# EAGLE board WB_2.8 (EAGLE 6.4), part 1 of 2
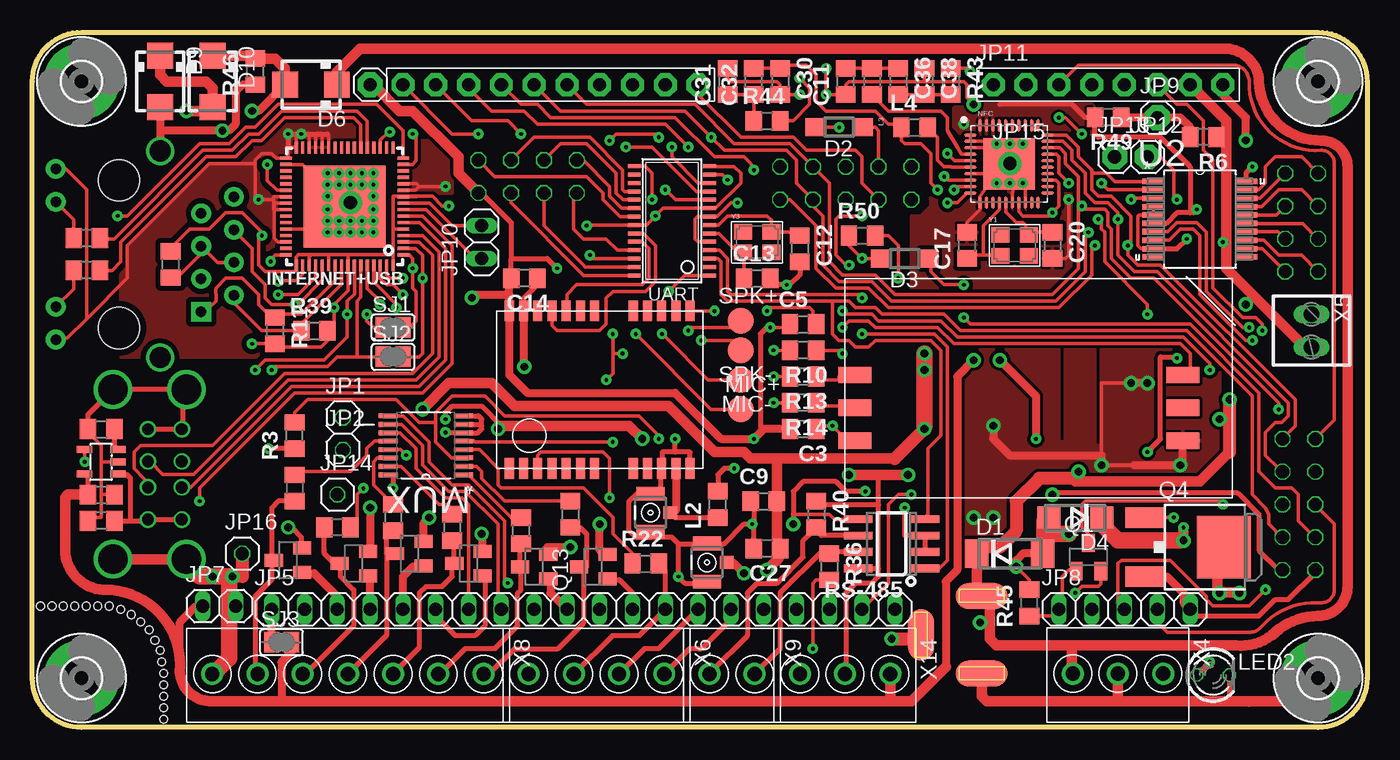
[diagram p5: board, top side]
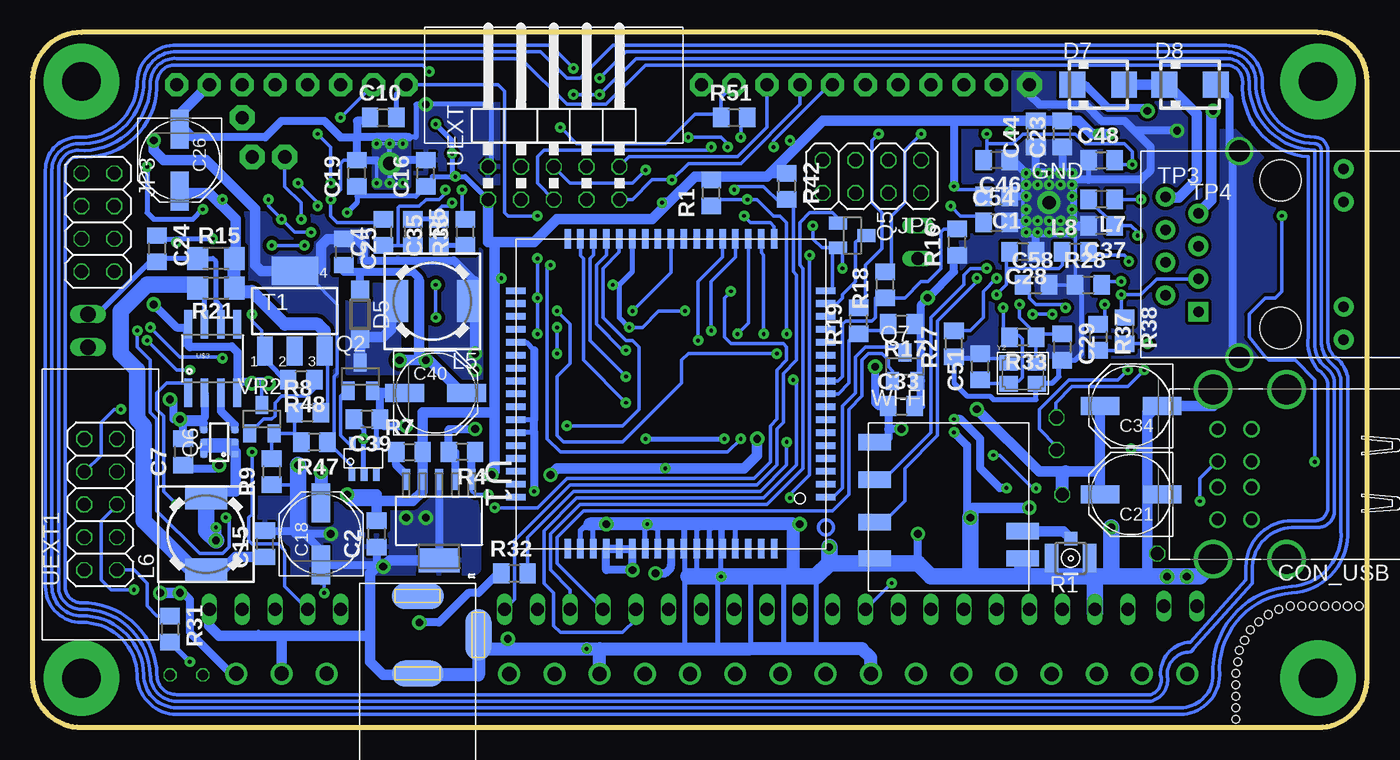
[diagram p6: board, bottom side, seen from below]

Size 103.38 x 53.85 mm. Coordinates in mm from the lower left corner, seen from the top.
Outline: 0,50.04 arc-90 3.81,53.85 99.57,53.85 arc-90 103.38,50.04 103.38,3.81 arc-90 99.57,0 3.81,0 arc-90 0,3.81 0,50.04
Copper layers (1*16): Top 0.035mm / dielectric 1.5mm / Bottom 0.035mm
Design rules "default": minimum track width 10mil, minimum drill 0.3mm, track to track 8mil, track to pad 8mil, pad to pad 8mil, via to via 8mil, smd to smd 8mil, copper to edge 20mil, drill to drill 10mil, minimum pad ring 4mil, minimum via ring 10mil, stop-mask expansion 6mil, vias tented up to drill 50mil, thermal gap 8mil
Net classes: 1 PWR: width 0.203 mm, drill 0.4 mm, clearance 0.076 mm
Holes 0.6 mm at 0.63,9.4 1.52,9.4 5.08,9.4 5.97,9.4 7.65,8.74 8.41,8.18 9.07,7.54 9.91,5.97 10.03,5.08 10.16,4.19 10.16,2.41 10.16,1.52 10.16,0.64 10.16,3.3 2.41,9.4 3.3,9.4 4.19,9.4 6.83,9.14 9.5,6.76
tRestrict: area 33,34.5 to 34,34.8

## Footprints (pad centres in the part's own frame; a part is rotated, then mirrored left to right if it is on the bottom)
C0805_5MIL_D = smd 1.27 x 1.524: 1 -1.016,0; 2 1.016,0
PANASONIC_D = smd 3 x 1.4: + 2.4,0; - -2.4,0
HR911105A = drill 0.813 pad 1.524 square: 1 4.445,-6.35 | drill 0.813 pad 1.524: 2 3.175,-8.89; 3 1.905,-6.35; 4 0.635,-8.89; 5 -0.635,-6.35; 6 -1.905,-8.89; 7 -3.175,-6.35; 8 -4.445,-8.89; 9 6.604,4.902; 10 4.064,4.902; 11 -4.064,4.902; 12 -6.604,4.902 | drill 1.651 pad 2.159: 13 8.001,-3.175; 14 -8.001,-3.175 | hole 3.2: 5.715,0; -5.715,0
2P = drill 0.92 pad 1.27: 1-1 3.98,3.5; 1-2 3.98,1; 1-3 3.98,-1; 1-4 3.98,-3.5; 2-1 6.6,3.5; 2-2 6.6,1; 2-3 6.6,-1; 2-4 6.6,-3.5 | drill 2.3 pad 3: M1 1.27,6.57; M2 1.27,-6.57; M3 6.95,6.57; M4 6.95,-6.57
DO214AA = smd 1.8 x 2.2: A 2.55,0; C -2.55,0
SOD123 = smd 1.4 x 1.4: A 1.9,0; C -1.9,0
DO214AC = smd 1.8 x 1.7: A 2.05,0; C -2.05,0
SMA = smd 2 x 2: A 2,0; C -2,0
1X01-CLEANBIG = drill 1.016 pad 1.778: 1 0,0
SMT = smd 1.5 x 0.508: 1 -11.64,7.27; 2 -11.64,6.27; 3 -11.64,5.27; 4 -11.64,4.27; 5 -11.64,3.27; 6 -11.64,2.27; 7 -11.64,1.27; 8 -11.64,0.27; 9 -11.64,-0.73; 10 -11.64,-1.73; 11 -11.64,-2.73; 12 -11.64,-3.73; 13 -11.64,-4.73; 14 -11.64,-5.73; 15 -11.64,-6.73; 16 -11.64,-7.73; 17 -11.64,-8.73; 35 12.36,-8.73; 36 12.36,-7.73; 37 12.36,-6.73; 38 12.36,-5.73; 39 12.36,-4.73; 40 12.36,-3.73; 41 12.36,-2.73; 42 12.36,-1.73; 43 12.36,-0.73; 44 12.36,0.27; 45 12.36,1.27; 46 12.36,2.27; 47 12.36,3.27; 48 12.36,4.27; 49 12.36,5.27; 50 12.36,6.27; 51 12.36,7.27 | smd 0.508 x 1.5: 18 -7.64,-12.73; 19 -6.64,-12.73; 20 -5.64,-12.73; 21 -4.64,-12.73; 22 -3.64,-12.73; 23 -2.64,-12.73; 24 -1.64,-12.73; 25 -0.64,-12.73; 26 0.36,-12.73; 27 1.36,-12.73; 28 2.36,-12.73; 29 3.36,-12.73; 30 4.36,-12.73; 31 5.36,-12.73; 32 6.36,-12.73; 33 7.36,-12.73; 34 8.36,-12.73; 52 8.36,11.27; 53 7.36,11.27; 54 6.36,11.27; 55 5.36,11.27; 56 4.36,11.27; 57 3.36,11.27; 58 2.36,11.27; 59 1.36,11.27; 60 0.36,11.27; 61 -0.64,11.27; 62 -1.64,11.27; 63 -2.64,11.27; 64 -3.64,11.27; 65 -4.64,11.27; 66 -5.64,11.27; 67 -6.64,11.27; 68 -7.64,11.27
3,0-PAD = drill 3 pad 5.842: B3,0 0,0
QFN64 = smd 0.9 x 0.25: 1 -4.55,3.75; 2 -4.55,3.25; 3 -4.55,2.75; 4 -4.55,2.25; 5 -4.55,1.75; 6 -4.55,1.25; 7 -4.55,0.75; 8 -4.55,0.25; 9 -4.55,-0.25; 10 -4.55,-0.75; 11 -4.55,-1.25; 12 -4.55,-1.75; 13 -4.55,-2.25; 14 -4.55,-2.75; 15 -4.55,-3.25; 16 -4.55,-3.75; 33 4.55,-3.75; 34 4.55,-3.25; 35 4.55,-2.75; 36 4.55,-2.25; 37 4.55,-1.75; 38 4.55,-1.25; 39 4.55,-0.75; 40 4.55,-0.25; 41 4.55,0.25; 42 4.55,0.75; 43 4.55,1.25; 44 4.55,1.75; 45 4.55,2.25; 46 4.55,2.75; 47 4.55,3.25; 48 4.55,3.75 | smd 0.25 x 0.9: 17 -3.75,-4.55; 18 -3.25,-4.55; 19 -2.75,-4.55; 20 -2.25,-4.55; 21 -1.75,-4.55; 22 -1.25,-4.55; 23 -0.75,-4.55; 24 -0.25,-4.55; 25 0.25,-4.55; 26 0.75,-4.55; 27 1.25,-4.55; 28 1.75,-4.55; 29 2.25,-4.55; 30 2.75,-4.55; 31 3.25,-4.55; 32 3.75,-4.55; 49 3.75,4.55; 50 3.25,4.55; 51 2.75,4.55; 52 2.25,4.55; 53 1.75,4.55; 54 1.25,4.55; 55 0.75,4.55; 56 0.25,4.55; 57 -0.25,4.55; 58 -0.75,4.55; 59 -1.25,4.55; 60 -1.75,4.55; 61 -2.25,4.55; 62 -2.75,4.55; 63 -3.25,4.55; 64 -3.75,4.55 | smd 6.35 x 6.35: 65 0,0
1X01 = drill 1.016 octagon: 1 0,0
2X04 = drill 1.016 octagon: 1 -3.81,-1.27; 2 -3.81,1.27; 3 -1.27,-1.27; 4 -1.27,1.27; 5 1.27,-1.27; 6 1.27,1.27; 7 3.81,-1.27; 8 3.81,1.27
1X01' = drill 1.016 pad 1.93 octagon: 1 0,0
1X20 = drill 1.016 long: 1 -24.13,0; 2 -21.59,0; 3 -19.05,0; 4 -16.51,0; 5 -13.97,0; 6 -11.43,0; 7 -8.89,0; 8 -6.35,0; 9 -3.81,0; 10 -1.27,0; 11 1.27,0; 12 3.81,0; 13 6.35,0; 14 8.89,0; 15 11.43,0; 16 13.97,0; 17 16.51,0; 18 19.05,0; 19 21.59,0; 20 24.13,0
1X02 = drill 1.016 long: 1 -1.27,0; 2 1.27,0
1X05 = drill 1.016 long: 1 -5.08,0; 2 -2.54,0; 3 0,0; 4 2.54,0; 5 5.08,0
1X08-BIG = drill 1.016 pad 1.778 octagon: 1 -8.89,0; 2 -6.35,0; 3 -3.81,0; 4 -1.27,0; 5 1.27,0; 6 3.81,0; 7 6.35,0; 8 8.89,0
L0805_5MIL_D = smd 1.27 x 1.524: 1 -1.016,0; 2 1.016,0
DR74 = smd 1.8 x 3.25: 1 -2.8,0; 2 2.8,0
LED3MM = drill 0.813 octagon: A -1.27,0; K 1.27,0
TP20R = smd 2 x 2: TP 0,0
SOP65P640X120-16N = smd 1.473 x 0.356: 1 -2.921,2.286; 2 -2.921,1.626; 3 -2.921,0.965; 4 -2.921,0.33; 5 -2.921,-0.33; 6 -2.921,-0.965; 7 -2.921,-1.626; 8 -2.921,-2.286; 9 2.921,-2.286; 10 2.921,-1.626; 11 2.921,-0.965; 12 2.921,-0.33; 13 2.921,0.33; 14 2.921,0.965; 15 2.921,1.626; 16 2.921,2.286
HVQFN40-6X6 = smd 1 x 0.25: 1 -2.99,2.25; 2 -2.99,1.75; 3 -2.99,1.25; 4 -2.99,0.75; 5 -2.99,0.25; 6 -2.99,-0.25; 7 -2.99,-0.75; 8 -2.99,-1.25; 9 -2.99,-1.75; 10 -2.99,-2.25; 21 2.99,-2.25; 22 2.99,-1.75; 23 2.99,-1.25; 24 2.99,-0.75; 25 2.99,-0.25; 26 2.99,0.25; 27 2.99,0.75; 28 2.99,1.25; 29 2.99,1.75; 30 2.99,2.25 | smd 0.25 x 1: 11 -2.25,-2.99; 12 -1.75,-2.99; 13 -1.25,-2.99; 14 -0.75,-2.99; 15 -0.25,-2.99; 16 0.25,-2.99; 17 0.75,-2.99; 18 1.25,-2.99; 19 1.75,-2.99; 20 2.25,-2.99; 31 2.25,2.99; 32 1.75,2.99; 33 1.25,2.99; 34 0.75,2.99; 35 0.25,2.99; 36 -0.25,2.99; 37 -0.75,2.99; 38 -1.25,2.99; 39 -1.75,2.99; 40 -2.25,2.99 | smd 4 x 4: TP 0,0
SO-6/4 = smd 0.508 x 1.016: 1 -0.4,-1.5; 2 0.55,-1.5; 3 1.5,-1.5; 4 1.5,0.9; 5 -0.365,0.9
1 = smd 4 x 2 bottom: 1 0,7; P$4 0,1 | smd 4 x 2: 2 0,7; P$1 0,1 | smd 2 x 4 bottom: P$5 4.7,4 | smd 2 x 4: P$6 4.7,4
SOT23 = smd 1 x 1.4: 1 -0.95,-1.1; 2 0.95,-1.1; 3 0,1.1
DPAK = smd 1.6 x 3: 1 -2.28,-4.04; 3 2.28,-4.04 | smd 4.826 x 4.191: 4 0,2.096
SC74_INFINEON = smd 0.5 x 0.5: 1 -0.95,-1.2; 2 0,-1.2; 3 0.95,-1.2; 4 0.95,1.2; 5 0,1.2; 6 -0.95,1.2
R0805_5MIL_D = smd 1.27 x 1.524: 1 -1.016,0; 2 1.016,0
R1206 = smd 1.6 x 1.803: 1 -1.422,0; 2 1.422,0
SOIC8 = smd 0.6 x 2.2: 1 -1.905,-2.6; 2 -0.635,-2.6; 3 0.635,-2.6; 4 1.905,-2.6; 5 1.905,2.6; 6 0.635,2.6; 7 -0.635,2.6; 8 -1.905,2.6
SIM68V = smd 1.6 x 0.7: 1 -6.35,6.62; 2 -6.35,5.52; 3 -6.35,4.42; 4 -6.35,3.32; 5 -6.35,2.22; 6 -6.35,1.12; 7 -6.35,0.02; 8 -6.35,-2.98; 9 -6.35,-4.08; 10 -6.35,-5.18; 11 -6.35,-6.28; 12 -6.35,-7.38; 13 5.85,-7.38; 14 5.85,-6.28; 15 5.85,-5.18; 16 5.85,-4.08; 17 5.85,-2.98; 18 5.85,0.02; 19 5.85,1.12; 20 5.85,2.22; 21 5.85,3.32; 22 5.85,4.42; 23 5.85,5.52; 24 5.85,6.62
BIGSIM = smd 2.54 x 1.27: 1 14.24,2.54; 2 14.24,0; 3 14.24,-2.54; 4 -11.16,2.54; 5 -11.16,0; 6 -11.16,-2.54
SJ = smd 1.168 x 1.6: 1 -0.762,0; 2 0.762,0
SOT223 = smd 1.219 x 2.235: 1 -2.311,-3.099; 2 0,-3.099; 3 2.311,-3.099 | smd 3.6 x 2.2: 4 0,3.099
B1,27 = smd 1.27 x 1.27: TP 0,0
SOT230P700X180-6N = smd 1.626 x 0.61: 1 -3.2,2.54; 2 -3.2,1.27; 3 -3.2,0; 4 -3.2,-1.27; 5 -3.2,-2.54 | smd 1.854 x 3.175: 6 3.073,0
SOP65P780X200-20N = smd 1.676 x 0.432: 1 -3.607,2.921; 2 -3.607,2.286; 3 -3.607,1.626; 4 -3.607,0.965; 5 -3.607,0.33; 6 -3.607,-0.33; 7 -3.607,-0.965; 8 -3.607,-1.626; 9 -3.607,-2.286; 10 -3.607,-2.921; 11 3.607,-2.921; 12 3.607,-2.286; 13 3.607,-1.626; 14 3.607,-0.965; 15 3.607,-0.33; 16 3.607,0.33; 17 3.607,0.965; 18 3.607,1.626; 19 3.607,2.286; 20 3.607,2.921
SOIC-8 = smd 0.61 x 2.21: 1 -1.905,-2.54; 2 -0.635,-2.54; 3 0.635,-2.54; 4 1.905,-2.54; 5 1.905,2.794; 6 0.635,2.794; 7 -0.635,2.794; 8 -1.905,2.794
1X10-BIG = drill 1.016 pad 1.778 octagon: 1 -11.43,0; 2 -8.89,0; 3 -6.35,0; 4 -3.81,0; 5 -1.27,0; 6 1.27,0; 7 3.81,0; 8 6.35,0; 9 8.89,0; 10 11.43,0
SOT23-5L = smd 0.55 x 1.2: 1 -0.95,-1.3; 2 0,-1.3; 3 0.95,-1.3; 4 0.95,1.3; 5 -0.95,1.3
TSSOP28 = smd 0.305 x 0.991: CDA -3.575,2.918; CDB 0.975,2.918; CS 1.625,-2.918; CTSA -3.575,-2.918; CTSB 3.575,2.918; DSRA -2.275,2.918; DSRB 2.275,2.918; DTRA -2.925,2.918; DTRB 1.625,2.918; IRQ 4.225,2.918; RESET -1.625,-2.918; RIA -4.225,2.918; RIB 0.325,2.918; RTSA -4.225,-2.918; RTSB 2.925,2.918; RXA -2.275,-2.918; RXB -1.625,2.918; SCLK 3.575,-2.918; SI 2.275,-2.918; SO 2.925,-2.918; SPI 0.975,-2.918; TXA -2.925,-2.918; TXB -0.975,2.918; VDD 0.325,-2.918; VSS 4.225,-2.918; VSS2 -0.325,2.918; XTAL1 -0.975,-2.918; XTAL2 -0.325,-2.918
2X05/90 = drill 1.016 octagon: 1 -5.08,-6.35; 2 -5.08,-3.81; 3 -2.54,-6.35; 4 -2.54,-3.81; 5 0,-6.35; 6 0,-3.81; 7 2.54,-6.35; 8 2.54,-3.81; 9 5.08,-6.35; 10 5.08,-3.81
2X05 = drill 1.016 octagon: 1 -5.08,-1.27; 2 -5.08,1.27; 3 -2.54,-1.27; 4 -2.54,1.27; 5 0,-1.27; 6 0,1.27; 7 2.54,-1.27; 8 2.54,1.27; 9 5.08,-1.27; 10 5.08,1.27
BL-8188-PACK = smd 2.54 x 1.27: 3.3V -5.73,5; ANT 5.73,-1.9; DM- -5.73,2.1; DP+ -5.73,-1.2; GND1 -5.73,-4; GND2 5.73,-4
MC-921 = smd 1 x 1.05: 1 0,1.528 | smd 1.05 x 2.2: 2@1 -1.475,0; 2@2 1.475,0
1751251 = drill 1.1 pad 1.7: 1 -3.5,-0.1; 2 0,-0.1; 3 3.5,-0.1
2POL254 = drill 1.2 long: 1 -1.27,0; 2 1.27,0
1751264 = drill 1.1 pad 1.7: 1 -5.25,-0.1; 2 -1.75,-0.1; 3 1.75,-0.1; 4 5.25,-0.1
1751293 = drill 1.1 pad 1.7: 1 -10.5,-0.1; 2 -7,-0.1; 3 -3.5,-0.1; 4 0,-0.1; 5 3.5,-0.1; 6 7,-0.1; 7 10.5,-0.1
1751248 = drill 1.1 pad 1.7: 1 -1.75,-0.1; 2 1.75,-0.1
CRYSTAL_3.2X2.5 = smd 1.4 x 1.2: 1 -1.1,-0.8; 2 1.1,0.8; GND1 -1.1,0.8; GND2 1.1,-0.8

## Placement (x,y rotation side)
C1  10uF  [C0805_5MIL_D]  28.7,41.15 180 bottom
C2  10uF  [C0805_5MIL_D]  76.71,14.99 90 bottom
C3  100nF  [C0805_5MIL_D]  59.69,23.11 180 top
C4  100nF  [C0805_5MIL_D]  76.2,38.35 90 bottom
C5  10uF  [C0805_5MIL_D]  59.69,31.24 0 top
C6  10uF  [C0805_5MIL_D]  5.33,18.03 0 top
C7  10uF25V  [C0805_5MIL_D]  91.69,21.34 90 bottom
C9  10uF  [C0805_5MIL_D]  56.64,17.53 0 top
C10  10uF  [C0805_5MIL_D]  76.2,47.24 0 bottom
C11  220pF  [C0805_5MIL_D]  62.99,50.04 90 top
C12  22pF  [C0805_5MIL_D]  59.44,37.08 270 top
C13  22pF  [C0805_5MIL_D]  56.13,34.8 0 top
C14  10uF  [C0805_5MIL_D]  38.1,34.8 180 top
C15  10uF  [C0805_5MIL_D]  85.34,14.22 90 bottom
C16  10uF  [C0805_5MIL_D]  72.9,42.93 90 bottom
C17  22pF  [C0805_5MIL_D]  72.39,37.34 90 top
C18  100uF 25V  [PANASONIC_D]  81.03,14.99 90 bottom
C19  100nF  [C0805_5MIL_D]  78.23,42.93 90 bottom
C20  22pF  [C0805_5MIL_D]  78.99,37.34 270 top
C21  330uF 6.3V  [PANASONIC_D]  18.29,18.03 180 bottom
C22  10uF  [C0805_5MIL_D]  5.33,16 180 top
C23  100nF  [C0805_5MIL_D]  23.62,45.97 90 bottom
C24  10uF  [C0805_5MIL_D]  93.73,37.08 270 bottom
C25  10uF  [C0805_5MIL_D]  79.25,36.83 270 bottom
C26  330uF 6.3V  [PANASONIC_D]  91.95,43.94 270 bottom
C27  100nF  [C0805_5MIL_D]  56.9,13.84 180 top
C28  10uF  [C0805_5MIL_D]  26.67,36.83 180 bottom
C29  22pF  [C0805_5MIL_D]  23.62,29.46 270 bottom
C30  220pF  [C0805_5MIL_D]  57.91,50.04 270 top
C31  56pF  [C0805_5MIL_D]  53.85,50.04 90 top
C32  22pF  [C0805_5MIL_D]  55.88,50.04 90 top
C33  10uF  [C0805_5MIL_D]  36.07,24.89 0 bottom
C34  330uF 6.3V  [PANASONIC_D]  18.29,24.89 180 bottom
C35  1000pF 20%  [C0805_5MIL_D]  71.88,38.35 90 bottom
C36  22pF  [C0805_5MIL_D]  67.06,50.04 270 top
C37  100nF  [C0805_5MIL_D]  20.57,38.86 180 bottom
C38  56pF  [C0805_5MIL_D]  69.09,50.04 270 top
C39  10uF  [C0805_5MIL_D]  77.47,23.88 180 bottom
C40  100uF 6.3V  [PANASONIC_D]  72.14,25.91 0 bottom
C44  100nF  [C0805_5MIL_D]  25.65,45.97 90 bottom
C46  100nF  [C0805_5MIL_D]  28.7,43.94 180 bottom
C48  10uF  [C0805_5MIL_D]  20.57,43.94 0 bottom
C51  22pF  [C0805_5MIL_D]  29.97,27.94 90 bottom
C54  100nF  [C0805_5MIL_D]  28.7,39.12 0 bottom
C58  10uF  [C0805_5MIL_D]  25.65,34.28 0 bottom
CON_ETHERNET  HR911105A  [HR911105A]  6.72,36.65 270 bottom
CON_USB  USB_2P  [2P]  4.98,19.6 180 bottom
D1  SM6T22A  [DO214AA]  75.69,13.46 0 top
D2  PMEG3010ER  [SOD123]  62.48,46.48 180 top
D3  PMEG3010ER  [SOD123]  67.56,36.32 180 top
D4  PMEG4030EP  [DO214AC]  80.77,16.26 180 top
D5  PMEG3010ER  [SOD123]  77.98,32 270 bottom
D6  S1G-13-F (any SMA)  [SMA]  21.59,49.78 180 top
D7  S1G-13-F (any SMA)  [SMA]  20.83,49.78 0 bottom
D8  S1G-13-F (any SMA)  [SMA]  13.72,49.78 0 bottom
D9  S1G-13-F (any SMA)  [SMA]  9.91,50.04 270 top
D10  S1G-13-F (any SMA)  [SMA]  13.97,50.04 270 top
GND  [1X01-CLEANBIG]  24.64,40.64 0 bottom
GSM1  SIM900TOP_LAY  [SMT]  53.56,25.11 180 bottom
H1  MOUNT-PAD-ROUND3.0  [3,0-PAD]  3.81,3.81 0 top
H2  MOUNT-PAD-ROUND3.0  [3,0-PAD]  99.57,3.81 0 top
H3  MOUNT-PAD-ROUND3.0  [3,0-PAD]  3.81,50.04 0 top
H4  MOUNT-PAD-ROUND3.0  [3,0-PAD]  99.57,50.04 0 top
INTERNET+USB  LAN9514  [QFN64]  24.2,40.36 180 top
JP1  pin hole  [1X01]  24.05,24 0 top
JP2  pin hole  [1X01]  24.05,21.49 0 top
JP3  [2X04]  98.3,39.12 270 bottom
JP4  [1X01']  26.16,49.78 0 top
JP5  [1X20]  42.67,9.14 0 top
JP6  [2X04]  38.35,42.67 180 bottom
JP7  [1X02]  14.48,9.4 0 top
JP8  [1X05]  84.58,9.14 0 top
JP9  pin hole  [1X01']  87.12,47.24 0 top
JP10  [1X02]  34.8,37.59 90 top
JP11  [1X08-BIG]  83.31,49.78 0 top
JP12  [1X01']  86.36,44.2 0 top
JP13  [1X01']  83.82,44.2 0 top
JP14  [1X01]  23.62,18.03 0 top
JP15  [1X01-CLEANBIG]  75.69,43.69 0 top
JP16  [1X01]  16.26,13.46 0 top
L2  100nH 500mA  [L0805_5MIL_D]  53.09,17.27 90 top
L3  560nH 5%  [L0805_5MIL_D]  65.02,50.04 270 top
L4  560nH 5%  [L0805_5MIL_D]  68.33,46.48 0 top
L5  10 uH  [DR74]  72.39,33.02 180 bottom
L6  10 uH  [DR74]  89.92,14.99 90 bottom
L7  100nH 500mA  [L0805_5MIL_D]  20.57,40.89 180 bottom
L8  100nH 500mA  [L0805_5MIL_D]  22.61,36.83 0 bottom
LED2  Green d=3 mm  [LED3MM]  91.44,4.06 0 top
MIC+  PAD  [TP20R]  54.86,24.64 0 top
MIC-  PAD  [TP20R]  54.86,26.92 0 top
MUX  SN74HC4851PW  [SOP65P640X120-16N]  30.48,21.84 180 top
NFC  PN532  [HVQFN40-6X6]  75.64,43.64 0 top
POWER_5V  NCP1450ASN50T1G  [SO-6/4]  78.23,21.08 0 bottom
POWERJACK  POWERJACK  [1]  73.53,3.17 0 bottom
Q1  2N7002  [SOT23]  81.79,13.21 0 top
Q2  IRLML6344  [SOT23]  77.98,27.18 0 bottom
Q4  NTD5865  [DPAK]  90.17,13.97 270 top
Q5  2N7002  [SOT23]  39.88,38.1 270 bottom
Q6  BSL307SP  [SC74_INFINEON]  88.9,22.1 90 bottom
Q7  2N7002  [SOT23]  35.81,27.94 0 bottom
Q8  IRLML6344  [SOT23]  19.81,12.95 90 top
Q9  IRLML6344  [SOT23]  24.89,12.7 90 top
Q10  IRLML6344  [SOT23]  29.21,13.46 90 top
Q11  IRLML6344  [SOT23]  33.78,12.7 90 top
Q12  IRLML6344  [SOT23]  38.86,12.45 90 top
Q13  IRLML6344  [SOT23]  43.43,12.45 90 top
R1  1k  [R0805_5MIL_D]  50.8,41.4 90 bottom
R3  33k  [R0805_5MIL_D]  20.32,22.61 90 top
R4  33k  [R0805_5MIL_D]  70.1,21.34 180 bottom
R5  1k  [R0805_5MIL_D]  73.91,38.35 270 bottom
R6  6.8k  [R0805_5MIL_D]  90.68,45.72 180 top
R7  33k  [R0805_5MIL_D]  74.17,21.34 0 bottom
R8  3.9k  [R0805_5MIL_D]  82.04,24.38 0 bottom
R9  33k  [R0805_5MIL_D]  84.84,19.81 90 bottom
R10  20R  [R0805_5MIL_D]  59.69,29.21 180 top
R11  49.9R/1%  [R0805_5MIL_D]  18.8,30.73 270 top
R12  560R  [R0805_5MIL_D]  4.22,35.4 180 top
R13  20R  [R0805_5MIL_D]  59.69,27.18 180 top
R14  20R  [R0805_5MIL_D]  59.69,25.15 180 top
R15  100mOm  [R1206]  89.15,36.32 0 bottom
R16  12k/1%  [R0805_5MIL_D]  31.75,37.59 90 bottom
R17  12k/1%  [R0805_5MIL_D]  36.07,31.24 180 bottom
R18  1.69k  [R0805_5MIL_D]  37.34,34.29 90 bottom
R19  1.69k  [R0805_5MIL_D]  39.37,31.5 90 bottom
R20  6.8k  [R0805_5MIL_D]  5.33,23.11 0 top
R21  50mOm  [R1206]  89.15,34.04 180 bottom
R22  12k/1%  [R0805_5MIL_D]  47.5,12.7 0 top
R23  12k/1%  [R0805_5MIL_D]  41.66,16.51 270 top
R24  12k/1%  [R0805_5MIL_D]  37.85,15.24 270 top
R25  12k/1%  [R0805_5MIL_D]  32.51,15.49 270 top
R26  12k/1%  [R0805_5MIL_D]  27.94,16.26 270 top
R27  12k/1%  [R0805_5MIL_D]  32,29.72 90 bottom
R28  12.4k/1%  [R0805_5MIL_D]  21.59,34.29 0 bottom
R29  12k/1%  [R0805_5MIL_D]  23.62,15.49 180 top
R30  12k/1%  [R0805_5MIL_D]  20.32,18.54 270 top
R31  49.9R/1%  [R0805_5MIL_D]  92.71,7.62 270 bottom
R32  200k  [R0805_5MIL_D]  66.04,11.94 0 bottom
R33  1M  [R0805_5MIL_D]  26.67,30.23 180 bottom
R34  560R  [R0805_5MIL_D]  4.22,37.9 180 top
R35  1.69k  [R0805_5MIL_D]  69.85,38.35 90 bottom
R36  560R  [R0805_5MIL_D]  61.72,12.45 270 top
R37  49.9R/1%  [R0805_5MIL_D]  20.83,30.23 270 bottom
R38  49.9R/1%  [R0805_5MIL_D]  18.8,30.73 270 bottom
R39  49.9R/1%  [R0805_5MIL_D]  21.84,30.73 0 top
R40  560R  [R0805_5MIL_D]  60.71,16.51 270 top
R41  10R/1%  [R0805_5MIL_D]  10.72,35.86 90 top
R42  33k  [R0805_5MIL_D]  44.96,41.91 270 bottom
R43  ???1.5R  [R0805_5MIL_D]  71.12,50.04 270 top
R44  ???1.5R  [R0805_5MIL_D]  56.9,46.99 0 top
R45  33k  [R0805_5MIL_D]  77.22,9.65 90 top
R46  33k  [R0805_5MIL_D]  17.27,50.8 90 top
R47  33k  [R0805_5MIL_D]  81.53,22.1 180 bottom
R48  560R  [R0805_5MIL_D]  82.55,26.92 180 bottom
R49  12.4k/1%  [R0805_5MIL_D]  83.31,47.24 180 top
R50  6.8k  [R0805_5MIL_D]  64.26,38.1 0 top
R51  6.8k  [R0805_5MIL_D]  49.02,47.24 0 bottom
RS-485  ADM3483ARZ  [SOIC8]  66.55,14.22 90 top
SIM68  SIM68  [SIM68V]  43.56,26.42 90 top
SIM_HOLDER  6393699-1, Sim holder  [BIGSIM]  77.94,24.76 180 top
SJ1  ploshadki pod paiku  [SJ]  27.94,30.99 0 top
SJ2  ploshadki pod paiku  [SJ]  27.94,28.7 0 top
SJ3  ploshadki pod paiku  [SJ]  19.3,6.6 0 top
SPK+  PAD  [TP20R]  54.86,31.5 0 top
SPK-  PAD  [TP20R]  54.86,29.21 0 top
T1  PNP 5A PBSS4021PZ  [SOT223]  83.06,32.26 0 bottom
TP3  contact for POE  [B1,27]  15.62,41.1 0 bottom
TP4  contact for POE  [B1,27]  13.11,39.83 0 bottom
U1  MCP1826T-3302E/DC  [SOT230P700X180-6N]  71.88,16 270 bottom
U2  MCP23S08-E/SS  [SOP65P780X200-20N]  90.42,39.37 0 top
U$3  LTC4002ES8-4.2  [SOIC-8]  89.41,28.45 0 bottom
U$4  [1X10-BIG]  40.13,49.78 0 top
U$15  SY6280  [SOT23-5L]  5.33,20.57 90 top
UART  !SC16IS752  [TSSOP28]  49.53,39.24 90 top
UEXT  IDC-10 Angle  [2X05/90]  62.99,47.24 0 bottom
UEXT1  IDC-10  [2X05]  98.09,17.27 90 bottom
VR2  TL431 без буквы M  [SOT23]  85.6,23.88 0 bottom
WI-FI  BL-8188  [BL-8188-PACK]  32.42,17.09 0 bottom
X1  UFL  [MC-921]  52.25,12.78 270 top
X2  UFL  [MC-921]  22.96,13.11 0 bottom
X3  UFL  [MC-921]  47.88,16.64 270 top
X4  klemmnik  [1751251]  84.07,4.06 180 top
X5  klemmnik 2.54  [2POL254]  99.06,30.73 270 top
X6  klemmnik  [1751264]  43.69,4.04 180 top
X8  klemmnik  [1751293]  24.44,4.04 180 top
X9  klemmnik  [1751248]  54.19,4.04 180 top
X14  klemmnik  [1751251]  62.94,4.04 180 top
Y1  27.12MHz-NFC  [CRYSTAL_3.2X2.5]  76.07,37.34 0 top
Y2  25MHz-LAN9512  [CRYSTAL_3.2X2.5]  26.67,27.43 0 bottom
Y3  14.7456 Mhz UART  [CRYSTAL_3.2X2.5]  56.13,37.59 0 top

## Tracks (layer width: path | path; a pad name or v marks a point on that pad's centre or on a via)
3.3V  (via drill 0.3, 0.6)
  Top 0.254: INTERNET+USB.40 18.7,40.61 | 18.7,40.61 18.7,41.11 INTERNET+USB.39 18.75,41.11 18.69,41.05 | 17.27,43.69 17.27,43.94 17.78,44.45 18.54,44.45 18.89,44.11 INTERNET+USB.33 19.72,44.11 19.81,44.2 | INTERNET+USB.46 19.04,37.61 18.72,37.92 18.72,40.72 18.54,40.89 | 18.54,40.89 18.03,40.89 | 18.03,40.89 18.54,40.89 | 18.54,40.89 18.69,41.05 | 18.69,41.05 18.69,41.12 | 17.27,43.69 17.27,41.15 v17.53,40.89 18.03,40.89 | CON_ETHERNET.12 2.62,43.25 4.22,41.65 4.22,31.84 | 4.22,31.84 4.22,31.65 2.72,30.15 1.93,30.15 CON_ETHERNET.9 | INTERNET+USB.41 18.7,40.11 18.7,40.61 | INTERNET+USB.11 29.67,41.61 29.97,41.91 | INTERNET+USB.12 29.78,42.11 29.97,41.91 | 70.87,42.42 v70.61,42.67 | NFC.23 79.27,42.4 79.5,42.16 79.5,40.39 v78.99,39.88 78.74,39.62 76.71,39.62 76.39,39.94 NFC.17 | 29.97,41.91 v32,41.91 | 4.22,31.84 4.32,31.75 7.37,34.8 7.37,37.34 13.72,43.69 17.27,43.69 | INTERNET+USB.30 21.45,45.86 21.34,45.97 | INTERNET+USB.29 21.95,45.87 | 21.95,45.87 21.84,45.97 | INTERNET+USB.28 22.45,45.88 22.35,45.97 | INTERNET+USB.27 22.95,45.89 22.86,45.97 | NFC.38 74.39,46.96 | NFC.39 73.89,46.97 | NFC.40 73.39,46.98 | UART.RESET 51.54,37.62 51.31,37.85 51.31,39.37 51.56,39.62 51.62,39.57 UART.VDD 53.03,39.57 54.1,40.64 v54.61,40.64 | NFC.5 71.42,43.9 v70.87,44.45 | 19.81,44.2 19.81,44.96 20.39,44.96 | 19.81,44.19 19.81,44.2 | 21.95,45.87 22,45.87 22.1,45.97 | MUX.16 27.94,19.56 28.19,19.56 | v48.51,45.72 48.26,45.97 45.21,45.97 v44.7,45.47 | R50.2 66.29,38.1 67.06,37.34 v67.06,34.8 | NFC.8 70.89,42.4 70.87,42.42 | 70.87,42.42 70.87,42.44 arc180 70.87,42.42 | INTERNET+USB.19 26.95,45.49 | 26.95,45.49 26.92,45.47
  Top 0.254: 26.95,45.49 27.58,46.13 v27.69,46.13 | INTERNET+USB.32 20.45,45.85 20.57,45.97
  Top 0.406: v32,23.88 32,24.38 32.51,24.89 34.8,24.89 36.32,23.37 | 72.39,46.99 v72.14,46.74 | v78.99,18.03 79.12,18.16 93.34,18.16 95,16.51 95,13.72 96.52,12.19 UEXT1.1 | 64.77,12.19 64.08,12.19 RS-485.8 65.53,12.32 | 65.53,12.32 65.53,17.27 | R40.1 60.96,17.27 65.53,17.27 | 65.53,12.32 65.53,11.68 65.02,11.18 63.75,11.18 62.99,10.41 62.99,4.32 62.94,4.27 X14.2 | 22.86,45.97 22.35,45.97 22.1,45.97 21.34,45.97 v20.83,45.97 20.57,45.97 v19.81,45.97 19.81,44.96 | 27.94,19.56 v27.94,18.54 | C14.1 39.12,34.29 38.04,33.21 SIM68.23 38.1,32.21 | 65.53,17.27 65.53,19.56 | 74.93,48.26 80.52,48.26 81.53,47.24 R49.2 82.3,45.97 82.55,45.72 87.38,45.72 89.66,43.43 89.66,39.88 | v54.36,20.07 53.59,20.07 53.09,19.56 L2.2 | U2.20 94.03,42.98 v94.49,43.43 | v90.17,40.13 89.92,39.88 89.66,39.88 | U2.6 87.81,39.04 88.65,39.88 89.66,39.88
  Top 0.61: v38.1,27.94 38.1,32.21
  Top 0.813: v67.82,19.56 65.53,19.56 v63.25,19.56 | v36.07,23.11 36.32,23.37 46.23,23.37 v47.24,22.35
  Bottom 0.254: L7.1 v17.53,40.89 | C1.2 29.72,41.66 32,41.66 v32,41.91 | R1.2 50.8,42.67 | 46.23,42.93 46.48,42.67 | R31.1 93.73,8.64 94.49,9.4 94.49,11.18 95.5,12.19 UEXT1.1 | R51.2 48.51,47.24 v48.51,45.72 | v44.7,45.47 44.2,44.96 | v67.06,34.8 67.56,35.31 67.56,37.59 | v27.69,46.13 27.69,46.99
  Bottom 0.406: v70.61,42.67 70.87,42.67 v70.87,44.45 70.87,45.47 v72.14,46.74 | UEXT.1 69.85,42.67 v70.61,42.67 | v70.61,42.67 72.39,42.67 72.39,41.91 C16.1 73.66,41.15 78.23,41.15 | C19.1 78.23,41.15 | 78.23,41.15 78.23,40.64 v78.99,39.88 | v94.49,43.43 94.49,39.88 93.98,39.37 90.93,39.37 v90.17,40.13
  Bottom 0.61: v27.94,18.54 28.45,18.54 29.97,20.07 29.97,22.35 31.5,23.88 v32,23.88 | 32,46.99 v32,41.91 | 67.56,19.81 v67.82,19.56 | WI-FI.3.3V 37.34,22.09 37.08,22.35 37.08,23.11 | 37.08,23.11 C33.1 37.85,24.89 38.1,25.15 v38.1,27.94 | v36.07,23.11 37.08,23.11
  Bottom 0.813: 54.1,40.64 55.37,39.37 62.74,39.37 64.52,37.59 67.56,37.59 | v54.61,40.64 54.1,40.64 | 54.1,40.64 52.07,42.67 50.8,42.67 46.48,42.67 44.2,44.96 42.16,46.99 32,46.99 27.69,46.99 C44.2 C23.2 22.35,46.99 21.34,45.97 v20.83,45.97 v19.81,45.97 | 67.56,24.38 73.15,24.38 R7.2 U1.4 73.15,18.29 73.91,17.53 78.74,17.53 78.74,17.78 v78.99,18.03 76.71,18.03 C2.2 | 67.56,24.38 67.56,19.81 | 67.56,24.38 67.56,37.59 | 67.56,37.59 68.07,37.59 UEXT.1 | R42.1 46.23,42.93 | v47.24,22.35 47.24,21.08 48.26,20.07 v54.36,20.07 62.74,20.07 v63.25,19.56
  pour Top (isolate 0.406): 6.86,46.74 19.05,46.74 18.8,28.7 6.86,28.7
  pour Top (isolate 0.254): 17.27,46.99 17.27,44.45 17.53,44.2 20.07,44.2 20.07,44.96 25.4,44.96 25.4,45.72 25.15,47.75 18.29,47.75
  pour Top (isolate 0.254): 29.21,41.4 29.21,43.94 29.97,45.47 32.51,45.47 32.51,41.4
  pour Top: 73.91,45.97 71.88,45.97 71.37,46.48 71.37,48.01 71.63,48.26 82.04,48.26 82.3,48.01 82.3,46.23 82.04,45.97
5-24V  (via drill 0.6)
  Top 0.61: v81.03,19.81 81.03,19.3 80.77,19.05 80.52,19.3 | D1.C 73.14,13.96 73.15,13.97 | v91.95,23.88 92.71,23.88
  Top 0.813: 80.52,6.35 93.22,6.35 arc47 96.27,7.37 arc-42 99.57,8.64 arc90 101.85,10.92 101.85,43.43 arc90 99.82,45.47 arc-90 95,50.04 arc90 92.2,52.58 25.4,52.58 23.62,50.8 23.62,50.04 23.59,50.01 D6.C | 80.52,4.22 80.52,4.11 X4.3 80.52,4.22 | 92.71,21.34 90.42,19.05 80.77,19.05 | 80.52,6.35 80.52,4.22 | 80.52,6.35 74.68,6.35 74.17,6.86 74.17,8.13 | 74.17,8.13 74.17,9.65 73.66,10.16 73.55,10.16 POWERJACK.1 73.42,10.18 73.41,10.16 73.14,10.42 D1.C | v73.41,8.13 74.17,8.13
  Top 1.016: v92.71,25.4 92.71,23.88 92.71,21.34 | 80.52,19.3 77.98,19.3 76.2,17.53 76.2,15.24 74.93,13.97 73.15,13.97
  Bottom 0.61: U$3.2 90.04,24 90.17,23.88 91.69,23.88 | R32.1 67.31,11.94 68.83,10.41 69.6,10.41 71.88,8.13 v73.41,8.13 | 81.03,17.53 80.77,17.53 80.91,17.39 C18.+ | v92.71,25.4 92.46,25.15 92.46,23.88 v91.95,23.88 | v91.95,23.88 91.95,23.62 90.17,23.62 90.1,23.55 Q6.4 | v91.95,23.88 91.69,23.88 | C7.2 91.69,23.88
  Bottom 1.016: v81.03,19.81 81.03,17.53
+4.1V  (via drill 0.6)
  Top 0.254: 94.03,47.19 92.2,49.02
  Top 0.61: 57.66,12.95 v56.9,12.19 | C27.1 57.91,13.21 57.79,13.08 | v93.98,45.47 93.98,47.24 92.2,49.02 JP11.8
  Top 0.813: 66.8,20.83 57.66,20.83 | 57.66,20.83 C9.2 57.66,12.95 | v69.09,23.11 69.09,23.37 | 57.79,13.08 v56.9,12.19 | 57.66,20.83 55.63,20.83 55.12,21.34 52.83,21.34 49.28,24.89 37.34,24.89 35.56,26.67 32.26,26.67 v30.23,24.64
  Top 1.016: 66.8,20.83 v69.09,23.11
  Top 1.27: 69.09,23.37 v69.09,28.96
  Bottom 0.254: POWER_5V.1 78.76,19.58 78.74,19.56 78.74,20.32 80.01,21.59 80.01,22.1 | 80.01,22.1 R47.1 | T1.4 81.79,35.36 | 81.79,35.36 81.79,35.56 81.53,35.56 | 80.01,22.1 80.01,27.18 79.76,27.43 79.76,32.77 81.79,34.8 81.79,35.36
  Bottom 0.61: GSM1.55 GSM1.56 | GSM1.56 GSM1.57 56.92,12.22 | v56.9,12.19 58.93,12.19 58.93,13.72 58.8,13.84 C27.1 GSM1.56 | 69.09,34.54 70.71,36.17 77.62,36.17 77.62,36.22 77.72,36.32 77.72,37.34 | U1.2 70.61,21.34 R4.2 71.12,23.11 v69.09,23.11
  Bottom 0.813: v93.98,45.47 93.98,44.7 93.22,43.94 89.92,43.94 86.11,40.13 86.11,35.81 85.65,35.36 T1.4 | 81.53,35.56 81.03,35.56 81.03,37.34 80.52,37.85 C25.1 78.23,37.85 77.72,37.34 | C34.+ 20.69,19.81 | 20.69,19.81 C21.+ | v30.23,24.64 25.4,19.81 23.37,19.81 20.69,19.81 | 69.09,34.54 69.09,32.51 | 69.09,32.51 v69.09,28.96 | 69.09,32.51 L5.1
  Bottom 1.016: JP14.1 23.62,19.56 23.37,19.81
  other vias: 69.09,27.69
  pour Bottom (isolate 0.305, no thermals): 68.58,26.92 68.58,39.62 86.87,39.88 86.87,27.18 79.76,27.18 79.76,35.05 74.17,35.05 74.17,26.92
+5V  (via drill 0.3, 0.6)
  Top 0.406: C6.1 4.32,19.59 4.32,19.56 4.25,19.62 U$15.5
  Top 0.61: v72.9,28.45 71.63,27.18 71.63,12.19 70.74,11.3 70.74,4.7 | v74.93,28.45 77.72,25.65 v77.72,22.35 | 11.43,4.32 11.43,8.13 12.7,9.4 JP7.1 | SJ3.2 20.07,5.84 19.3,5.08 19.3,2.03
  Top 0.813: 70.74,4.7 68.07,2.03 66.55,2.03 | C6.1 2.79,18.03 2.54,17.78 2.54,13.46 arc90 6.1,10.67 arc-90 11.43,4.32 arc90 13.97,2.03 19.3,2.03 66.55,2.03 | X14.1 66.44,2.14 66.55,2.03
  Bottom 0.406: POWER_5V.2 77.68,19.77 77.72,19.81 v77.72,22.35 77.72,23.11 C39.2
  Bottom 0.61: 69.58,25.91 70.1,25.91 | 72.64,28.45 v72.9,28.45 | C25.2 79.25,35.31 77.98,35.31 | 77.98,35.31 73.91,35.31 73.41,34.8 73.41,34.54 | D5.C 77.98,35.31
  Bottom 0.813: v74.93,28.45 73.41,28.45 | 73.41,28.45 v72.9,28.45 | 70.1,25.91 72.64,28.45 | 73.41,34.54 73.41,28.45 | 69.58,25.91 C40.+
A
  Top 0.406: 60.71,15.24 60.45,15.24 59.69,14.48 59.69,13.21 57.66,11.18 56.13,11.18 55.37,10.41 55.37,7.11 52.58,4.32 52.62,4.32 X9.2 | RS-485.6 61.09,14.86 60.71,15.24 | 60.71,15.24 R40.2
B
  Top 0.406: RS-485.7 61.59,13.59 | 61.59,13.59 R36.1 | 61.59,13.59 61.47,13.72 61.21,13.72 57.91,10.41 57.91,6.1 57.9,6.1 X9.1
CHRG  (via drill 0.3)
  Top 0.254: U2.7 87.94,38.41 88.65,39.12 90.17,39.12 90.93,38.35 90.93,33.78 93.73,30.99 v94.23,30.99
  Top 0.406: v86.36,21.34 87.38,22.35 87.38,28.7 88.65,28.7 v88.65,28.6
  Bottom 0.254: v86.36,21.34 86.36,16.51 86.61,16.26 86.61,14.48 86.36,14.22 84.33,14.22 83.82,13.72 83.82,10.92 JP8.2 | v94.23,30.99 91.95,28.7 88.9,28.7 88.8,28.6 v88.65,28.6
COMP
  Top 0.254: 79.5,8.64 79.76,8.64 79.76,11.68 80.26,12.19 80.77,12.19 80.84,12.13 Q1.1 | 79.5,8.64 JP8.1 | R45.1 79.5,8.64
CS_2
  Top 0.254: JP11.3 81.03,51.31 92.96,51.31 arc-90 94.23,50.04 94.23,49.53 arc90 99.82,44.7 arc-90 100.84,43.69 100.84,23.83 UEXT1.10
CS_NFC  (via drill 0.3)
  Top 0.254: NFC.27 79.3,44.4 79.5,44.2 79.5,42.93 v80.26,42.16 | v81.28,45.97 80.01,47.24 v79.5,47.24
  Bottom 0.254: v80.26,42.16 80.26,44.96 v81.28,45.97 | v79.5,47.24 JP11.2
CS_UART  (via drill 0.3)
  Top 0.254: UART.CS 49.81,40.87 v49.02,41.66
  Bottom 0.254: 45.47,40.64 44.45,40.64 44.45,35.31 44.2,35.05 44.2,28.45 45.21,27.43 45.21,23.62 45.72,23.11 45.72,20.32 47.24,18.8 61.72,18.8 66.04,14.48 66.04,9.91 JP5.20 | 45.47,40.64 46.74,41.91 48.77,41.91 v49.02,41.66 | 45.47,40.64 45.21,40.89 R42.2
CS_UEXT_GPIO
  Bottom 0.254: UEXT.10 57.15,44.2 48.77,44.2 46.48,46.48 U$4.8
DFGSDFG
  Top 0.406: R23.2 42.42,15.49 42.93,14.99 42.93,12.45 Q13.3 42.42,12.45 42.59,12.28 42.67,12.19 42.67,8.06 40.71,6.1 37.34,6.1 35.38,4.14 X8.1
DFTGSDFG
  Top 0.254: MUX.15 28.55,20.22 31.5,17.27 32.26,17.27 32.26,16.51 R25.1
ERTERVT
  Top 0.254: MUX.12 26.49,22.17 25.91,21.59 25.91,21.08 24.64,19.81 20.57,19.81 R30.1
FET_TB_2
  Top 0.61: JP5.3 23.62,10.16 21.84,11.94 21.08,11.94 21.02,12 Q8.1
FET_TB_3
  Top 0.254: 26.16,11.67 26.16,11.68 | 26.16,11.68 | 26.16,11.68 26.1,11.75 Q9.1
  Top 0.61: JP5.4 26.16,11.67
FET_TB_4
  Top 0.254: 30.24,12.45 Q10.1
  Top 0.61: JP5.5 28.7,11.68 29.46,12.45 30.24,12.45
FET_TB_5
  Top 0.254: Q11.1 34.88,11.85 35.05,11.68
  Top 0.406: 35.05,11.68 35.05,7.87 34.29,7.11 33.02,7.11 32.77,7.11 31.24,8.64 JP5.6
FET_TB_6
  Top 0.254: Q12.1 40.07,11.5 40.13,11.43 | 40.13,11.43
  Top 0.61: 40.13,11.43 40.13,10.41 JP5.10
FET_TB_7
  Top 0.406: Q13.1 44.89,11.5 44.96,11.43 45.47,11.43 46.48,10.41 JP5.12
GND  (via drill 0.3, 0.6)
  Top 0.254: INTERNET+USB.34 20.95,43.61 21.7,42.86 21.7,42.93 v22.86,42.93 | INTERNET+USB.44 21.7,38.61 21.7,38.73 22.86,38.73 v22.86,39.24 | 5.33,20.57 U$15.2 | 4.03,22.83 4.35,22.83 5.33,21.84 5.33,20.57 | v80.26,40.89 80.26,36.58 80.01,36.32 C20.2 | v57.15,30.99 58.42,30.99 C5.1 | C17.2 72.39,39.12 73.41,40.13 73.41,40.64 NFC.11 73.39,41.11 73.91,41.91 73.91,42.16 v74.68,42.16 | 57.4,34.29 57.4,34.8 57.15,35.05 C13.2 | UART.VSS 52.58,43.47 52.58,43.43 54.36,43.43 54.86,42.93 54.86,42.16 52.92,40.22 UART.SPI 48.85,40.22 v48.26,39.62 47.55,38.92 UART.VSS2 42.93,38.92 v42.93,38.86 | 58.67,34.29 v58.42,34.29 | SIM68.13 51.05,32.27 51.05,32.26 v52.83,32.26 | C6.2 5.33,18.03 | 5.33,20.57 5.33,18.03 | 5.33,18.03 5.33,16.26 4.57,16.26 C22.2 | v59.44,49.02 C30.2 57.91,49.78 57.66,50.04 54.1,50.04 53.85,50.29 C31.2 | R43.1 72.39,51.05 v72.64,50.8 | C38.1 69.09,50.04 | 69.09,50.04 63.25,50.04 62.99,49.78 C11.1 v61.47,49.02 v61.47,51.05 | v59.44,50.29 60.2,49.53 60.2,48.26 58.93,46.99 R44.2 | RS-485.5 62.1,16.13 61.72,16.51 58.93,16.51 | R36.2 60.71,11.43 60.45,11.18 v60.45,6.1 | R45.2 77.22,11.43 v76.2,12.45 | v92.2,37.59 92.46,37.85 | 69.09,50.04 72.14,50.04 72.39,49.78 72.39,48.77 v72.9,48.26 | NFC.7 74.89,42.9 NFC.TP 74.42,42.42 74.42,42.16 v74.68,42.16 | NFC.18 76.89,41.73 76.71,41.91 v76.71,42.16 | NFC.16 75.89,41.45 75.95,41.45 75.95,42.16 v74.68,42.16 | NFC.3 74.68,44.9 | 74.87,44.9 74.68,44.9 | 74.68,44.9 v74.68,45.21 | v76.71,45.21 75.95,45.21 75.76,45.4 NFC.2 72.65,45.46 72.64,45.47 72.65,45.48 NFC.1 | 86.87,40.39 U2.4 U2.5 85.67,39.7 85.6,39.62 85.6,37.34 85.85,37.08 U2.9 | Q1.2 82.74,11.11 82.55,10.92 81.28,10.92 v80.77,10.41
  Top 0.254: v85.09,26.67 82.8,26.67 v82.8,20.32
  Top 0.305: v82.8,20.32 85.34,20.32
  Top 0.406: SIM68.12 50.94,21.34 49.78,21.34 | 49.78,21.34 v49.78,22.35 | 4.03,22.83 R20.1 4.32,24.24 CON_USB.M2 CON_USB.M4 11.67,25.92 11.67,23.1 | v57.15,30.99 56.9,30.99 56.39,30.48 56.39,22.86 | 49.78,21.34 48.77,21.34 48.77,20.07 | v64.52,18.29 62.99,18.29 62.23,19.05 59.69,19.05 58.93,18.29 58.93,16.51 v58.93,15.75 | X1.2@2 52.12,11.18 50.55,11.18 v50.04,11.68 50.04,14.22 | 52.32,14.22 52.3,14.25 X1.2@1 | v58.42,34.29 57.4,34.29 | C12.2 59.44,35.05 58.67,34.29 | 36.94,34.66 C14.2 37.08,36.32 | 48.01,14.73 46.74,14.73 46.23,15.24 46.23,17.53 46.81,18.11 X3.2@1 47.93,18.11 48.01,18.03 48.03,18.06 48.69,18.06 48.69,19.99 48.77,20.07 | 52.32,14.18 X1.2@1 | 50.04,14.22 52.32,14.22 | 52.32,14.22 arc-223 X1.2@1 | 52.32,14.22 53.59,14.22 55.12,15.75 v55.75,15.75 | JP8.5 90.17,8.64 95,8.64 96.27,9.91 97.28,9.91 99.36,11.98 UEXT1.2 | 50.04,14.22 49.53,14.73 48.01,14.73 | 48.01,14.73 47.88,14.86 X3.2@2 | C27.2 55.88,15.75 v55.75,15.75 | 37.08,36.32 39.88,36.32 v40.64,35.56 | 34.54,41.66 JP6.2 34.8,41.4 37.08,39.12 37.08,36.32 | 26.42,49.78 JP4.1 | 48.77,20.07 SIM68.10 | 26.16,13.72 25.93,13.72 Q9.2 | v19.81,15.49 20.07,15.49 20.83,14.73 20.83,13.97 20.89,13.9 Q8.2 | CON_USB.1-4 CON_USB.2-4 11.67,23.1 | 11.67,23.1 11.68,23.11 | 94.23,2.03 94.23,1.78 | LED2.K 92.71,2.03 | U2.9 88.65,37.08 v89.41,37.85 | v32,22.86 32.26,22.86 32.26,22.81 MUX.6 34.49,22.81 34.8,23.11 34.8,23.37 | v75.69,45.21 JP15.1 | JP15.1 NFC.TP 75.6,43.69 JP15.1 | v75.69,42.16 JP15.1 | R3.1 v18.29,21.59 | C9.1 55.88,17.27 55.88,15.88 v55.75,15.75 | MUX.8 34.54,24.13 34.8,23.88 34.8,23.37 | MUX.7 34.7,23.47 34.8,23.37
  Top 0.61: Q11.2 34.88,14.82 34.8,14.82 v34.8,14.99 | Q12.2 39.88,13.4 39.88,13.97 v41.66,13.97 | 36.94,33.53 SIM68.24 36.94,27.32 38.35,25.91 49.78,25.91 53.34,22.35 v55.88,22.35 56.39,22.86 56.64,23.11 C3.2 | 36.94,33.53 36.94,34.66 | Q13.2 44.52,13.4 44.45,13.46 44.2,13.46 43.94,13.72 v43.94,15.75 | v74.42,23.37 74.42,22.35 75.69,21.08 82.8,21.08 v82.8,20.32 | 85.34,20.32 v88.9,20.32 89.08,20.32 89.08,22.1 89.15,22.1 89.15,22.16 SIM_HOLDER.4 | 9.91,47.75 9.9,47.74 | D1.A 76.71,13.46 76.2,12.95 v76.2,12.45 | v26.16,17.02 26.16,13.72 | Q10.2 30.31,15.83 v30.73,16.26 | R46.1 16.26,49.78 15.75,49.28 15.75,46.74 15.24,46.23 v14.73,46.23 9.91,46.23 | Q4.3 87.88,11.69 89.15,10.41 89.15,9.65 JP8.5 | 94.49,33.53 94.49,33.27 v93.98,32.77 | JP7.2 15.24,9.4 | v34.04,33.27 34.29,33.53 36.94,33.53 | 9.91,46.23 CON_ETHERNET.14 | D9.A 9.91,47.75 | 9.91,47.75 9.91,46.23 | D4.A 78.72,16.02 78.74,16 78.74,14.99 | 78.24,16.01 78.49,16.26 | v86.36,26.67 v85.09,26.67
  Top 0.813: H2.B3,0 97.79,2.03 94.23,2.03 92.71,2.03 84.07,2.03 | 84.07,2.03 X4.2 | 84.07,2.03 73.91,2.03 73.53,2.41 73.53,4.19 | 34.54,41.66 34.29,41.66 33.02,42.93 33.02,44.2 29.46,47.75 28.45,47.75 26.42,49.78 | CON_USB.M1 CON_USB.M3 | X5.2 98.55,29.46 94.49,33.53 92.46,35.56 92.46,37.85 92.46,45.72 | 92.46,45.72 92.46,46.99 JP11.7 | R6.1 92.46,45.72
  Top 1.016: D1.A 78.24,16.01 | JP16.1 16.26,11.68 v15.49,11.68 | v66.55,6.86 68.58,6.86 68.83,7.11 POWERJACK.P$5
  Top 1.27: X8.7 13.94,4.04 15.24,5.33 15.24,9.4 15.24,11.68 | v15.49,11.68 15.24,11.68 | 15.24,11.68 v13.97,11.68 12.95,11.68 11.93,12.71 CON_USB.M3 | 78.74,14.99 v80.26,14.99
  Top 1.676: GND.1 24.2,40.64 INTERNET+USB.65
  Bottom 0.254: 22.46,34.87 22.53,34.87 22.61,34.8 R28.1 | 29.98,28.59 28.05,28.59 | 31.97,28.67 R27.1 | C58.2 R28.1 | 22.35,34.04 22.35,34.29 R28.1 | 22.35,34.04 22.1,33.78 | 22.35,34.04 R28.1 | v72.64,50.8 73.15,51.31 92.2,51.31 arc-90 93.73,50.04 arc98 99.82,44.2 arc-90 100.84,43.18 100.84,10.92 arc-90 99.57,9.65 arc90 93.73,4.06 arc-90 92.2,2.54 16.76,2.54 arc-90 16,4.06 arc90 13.72,6.6 9.4,11.43 9.4,12.45 arc90 5.84,16 4.06,16 arc-90 3.05,17.02 3.05,26.67 arc-46 3.81,27.69 arc46 4.57,30.23 4.57,44.2 arc90 9.65,50.04 arc-90 10.92,51.31 55.88,51.31 58.93,48.26 61.98,48.26 65.53,51.82 92.2,51.82 arc-90 94.23,50.04 arc96 99.82,44.7 arc-90 101.35,43.18 101.35,10.92 arc-90 99.57,9.14 arc90 94.23,4.06 arc-90 92.2,2.03 16.76,2.03 arc-90 15.49,4.06 arc90 13.72,5.84 arc-59 13.46,6.1 8.89,11.18 8.89,12.19 arc90 5.84,15.49 3.81,15.49 arc-90 2.54,16.76 2.54,26.92 arc-46 3.3,27.94 arc46 4.06,29.72 4.06,44.7 arc90 9.14,50.04 arc-90 10.92,51.82 56.64,51.82 v59.44,49.02 v61.47,49.02 | C4.2 76.45,39.12 79.76,39.12 80.26,39.62 v80.26,40.89 79.5,41.66 79.5,43.69 79.25,43.94 C19.2 | GSM1.18 45.92,38.81 46.23,39.12 47.75,39.12 v48.26,39.62 | v52.83,32.26 54.86,32.26 56.13,30.99 v57.15,30.99 | v59.44,50.29 57.4,52.32 10.92,52.32 arc90 8.64,50.04 arc-90 4.06,45.21 arc90 3.56,44.7 3.56,29.97 arc-46 2.79,28.19 arc46 2.03,26.92 2.03,15.24 arc90 5.84,10.92 arc-90 11.94,4.06 arc90 14.48,1.52 92.2,1.52 arc90 94.74,4.06 arc-90 99.57,8.64 arc90 101.85,10.92 101.85,43.18 arc90 99.82,45.21 arc-93 94.74,50.04 arc90 92.2,52.32 64.01,52.32 61.98,50.29 60.96,50.29 58.42,52.83 10.92,52.83 arc90 8.13,50.04 arc-90 4.06,45.72 arc90 3.05,44.7 3.05,30.23 arc-46 2.54,28.7 arc46 1.52,27.18 1.52,15.24 arc90 5.84,10.41 arc-90 11.43,4.06 arc90 14.48,1.02 92.2,1.02 arc90 95.25,4.06 arc-90 99.57,8.13 arc90 102.36,10.92 102.36,43.18 arc90 99.82,45.72 99.57,45.72 arc-90 95.25,50.04 arc90 92.2,52.83 63.25,52.83 v61.47,51.05
  Bottom 0.254: GSM1.17 41.6,33.84 41.4,34.04 41.4,36.83 41.08,37.15 Q5.2 | 30.48,16.51 v30.73,16.26 | C24.1 93.73,37.85 | 92.2,37.85 v92.2,37.59 | v76.71,42.16 76.71,43.94 | v74.68,42.16 v75.69,42.16 v75.69,45.21 | v74.68,45.21 v75.69,45.21 | v76.71,45.21 v75.69,45.21 | v80.77,10.41 80.77,11.18 81.03,11.18 C18.- | 32,36.32 R16.1 | v42.93,38.86 42.93,37.85 42.23,37.15 Q5.2 | v40.64,35.56 40.64,36.83 40.96,37.15 Q5.2 | v85.09,26.67 85.6,26.67 VR2.3 85.6,24.89 | R9.1 82.8,18.8 | 22.61,42.42 22.61,43.18 23.62,43.18 25.65,43.18 26.67,43.18 26.67,41.15 26.67,38.86 26.67,38.1 25.65,38.1 22.61,38.1 | 22.61,38.1 22.61,38.86 22.61,42.42 | C37.2 21.7,38.86 21.7,38.61 22.86,38.61 v22.86,39.24 | 22.86,42.42 v22.86,39.24 | v22.86,39.24 22.86,39.12 | 22.61,42.42 22.86,42.42 | 22.86,42.42 v22.86,42.93 | R28.1 22.61,38.1
  Bottom 0.406: 22.1,33.78 22.1,28.96 22.61,28.45 C29.2 23.88,28.19 23.88,27.18 24.38,26.67 25.65,26.67 25.65,25.4 28.96,25.4 29.21,25.65 30.99,25.65 32,26.67 R27.1 31.75,28.7 31.64,28.59 29.98,28.59 C51.2 | UEXT.2 67.82,43.69 67.82,48.26 v72.9,48.26 73.66,48.26 73.66,45.72 74.17,45.72 | 59.94,15.49 59.18,15.49 v58.93,15.75 | GSM1.53 60.92,15.28 60.71,15.49 59.94,15.49 | 59.94,15.49 59.94,14.48 59.92,14.46 GSM1.54 59.92,13.95 59.94,13.97 59.94,14.32 | GSM1.58 55.92,15.7 55.88,15.75 | GSM1.59 54.92,15.55 55.12,15.75 | GSM1.39 65.14,29.84 64.52,29.21 | 64.52,22.86 64.54,22.84 GSM1.46 | GSM1.45 64.56,23.84 64.52,23.88 | GSM1.29 56.92,35.28 57.91,34.29 | C48.1 21.59,42.42 | v55.88,22.35 v49.78,22.35 | 48.92,15.65 49.02,15.75 49.02,15.49 48.92,15.4 GSM1.65 | GSM1.63 50.92,15.37 50.8,15.49 50.8,15.75 | 52.07,15.49 51.82,15.75 | GSM1.64 49.92,15.63 50.04,15.75 v50.04,11.68 | 51.75,15.75 52.83,15.75 | v57.15,30.99 57.91,31.75 57.91,34.29 | 57.91,34.29 v58.42,34.29 | 50.29,11.68 50.29,6.1 52.83,6.1 52.83,15.75 | 44.45,15.75 v43.94,15.75 | 51.92,15.6 GSM1.62 51.92,11.83 | 51.92,11.83 51.92,11.79 51.82,11.68 47.75,11.68 47.75,6.1 | GSM1.61 52.92,15.4 52.83,15.49 52.95,15.61 52.95,15.63 52.83,15.75 | JP4.1 26.16,49.53 | 51.92,11.83 52.07,11.68 52.58,11.68 | v89.41,37.85 92.2,37.85 93.73,37.85 | R17.1 34.54,30.73 | 76.71,43.94 75.69,43.94 | 75.69,43.94 v75.69,45.21 | 74.68,43.94 75.69,43.94 | 75.69,43.94 v75.69,42.16 | v18.29,21.59 17.02,21.59 | 85.85,7.37 85.85,7.11 | POWER_5V.4 76.73,23.6 C39.1 | C10.1 76.9,47.24 76.9,47.06 | 45.21,11.68 45.21,6.1 | 42.67,11.68 42.67,6.1
  Bottom 0.61: 18.03,46.23 16.76,44.96 16.76,43.18 17.53,42.42 21.59,42.42 22.61,42.42 | 64.52,29.21 64.52,23.88 64.52,22.86 v64.52,18.29 | 34.8,12.7 v34.8,14.99 | U$3.8 91.31,29.59 | 91.24,29.52 87.94,29.52 87.5,29.08 87.5,26.8 | 87.5,25.27 U$3.4 87.5,26.8 | 82.3,14.99 82.55,15.24 82.8,15.24 C15.2 | v74.42,23.37 76.2,23.37 76.2,23.88 C39.1 76.45,25.91 | v88.9,20.32 89.15,20.07 91.19,20.07 91.69,20.57 C7.1 | v14.73,46.23 18.03,46.23 | 18.03,46.23 18.8,46.99 20.57,46.99 21.84,48.26 25.4,48.26 26.16,49.02 26.16,49.53 | 91.24,29.52 91.31,29.59 | 91.31,29.59 91.44,29.72 91.44,30.99 92.2,30.99 v93.98,32.77 | 78.23,45.72 C19.2 76.71,43.94 | 10.41,44.7 10.41,29.21 9.9,28.7 CON_ETHERNET.13 | 72.16,12.93 U1.6 U1.3 | C44.1 25.65,44.2 25.7,44.2 25.7,43.22 25.65,43.18 | v76.2,12.45 76.34,12.59 C18.- 81.03,13.72 82.3,14.99 | 34.54,26.84 34.54,24.89 C33.2 | 34.54,26.84 34.54,30.73 34.54,32.77 v34.04,33.27 32,35.31 32,36.32 | 74.17,45.72 78.23,45.72 | C16.2 74.68,43.94 | C2.1 76.71,12.45 | 76.9,47.06 76.96,46.99 78.23,46.99 78.23,45.72 | 78.23,45.72 79.5,45.72 80.77,46.99 84.07,46.99 85.34,45.72 90.93,45.72 | 90.93,45.72 91.44,45.72 | D8.A 11.68,49.78 11.68,49.53 11.43,49.53 10.67,48.77 10.67,44.96 10.41,44.7 | CON_ETHERNET.14 9.91,44.7 10.41,44.7 | C26.- 91.55,46.34 90.93,45.72 | v80.26,14.99 82.3,14.99 | 87.5,26.8 86.23,26.8 | 85.22,26.8 86.23,26.8 | 86.23,26.8 v86.36,26.67 | C23.1 23.62,43.18 | C46.1 27.43,43.94 26.67,43.18 | C1.1 26.67,41.15 | C54.2 26.67,39.12 26.67,38.86 | C28.1 25.65,38.1 | C37.2 22.61,38.86 | v32,22.86 30.99,21.84 30.99,16.26 v30.73,16.26 | 91.24,29.52 91.19,29.46 | Q7.2 34.54,26.84
  Bottom 0.813: JP8.5 89.66,7.87 88.9,7.11 85.85,7.11 84.07,7.11 | X4.2 84.07,7.11 | 84.07,7.11 77.22,7.11 | 30.48,16.51 30.48,17.02 v26.16,17.02 | 77.22,7.11 77.22,5.08 76.2,4.06 73.66,4.06 73.55,4.17 POWERJACK.P$1 | 77.22,7.11 77.22,11.94 76.71,12.45 v76.2,12.45 75.69,12.95 72.14,12.95 72.16,12.93 | CON_USB.M4 11.93,24.9 16.25,24.9 17.02,24.13 | 17.02,24.13 17.02,21.59 17.02,18.03 | 17.02,18.03 17.02,11.68 | X2.2@2 21.48,12.09 21.34,11.94 | 21.34,11.94 21.08,11.94 | X2.2@1 24.43,11.64 24.38,11.68 | 21.34,11.94 21.59,11.94 21.59,11.68 | C21.- 17.02,18.03 | 15.24,24.89 C34.- 16.51,24.89 17.02,24.38 17.02,24.13 | 91.69,46.48 91.95,46.48 | 91.95,46.48 91.95,47.5 JP11.7 | C26.- 91.95,46.48 | C40.- 76.45,25.91 76.71,25.91 76.96,26.16 77.03,26.1 Q2.2
  Bottom 1.016: 44.45,11.68 44.45,15.75 49.02,15.75 50.04,15.75 50.8,15.75 51.75,15.75 51.82,15.75 52.83,15.75 55.12,15.75 v55.75,15.75 55.88,15.75 v58.93,15.75 60.2,15.75 | 66.55,6.1 68.83,6.1 68.83,4.06 73.42,4.06 POWERJACK.P$1 | 66.55,6.1 v60.45,6.1 59.44,6.1 | 59.44,6.1 47.75,6.1 45.21,6.1 42.67,6.1 39.12,6.1 38.44,5.42 X6.4 | X14.3 59.44,6.09 59.44,6.1 | v66.55,6.86 66.55,6.1
  Bottom 1.27: 19.81,11.68 17.02,11.68 v13.97,11.68 12.95,11.68 11.94,12.7 CON_USB.M3 | v30.73,16.26 30.73,11.68 | 30.73,11.68 33.78,11.68 34.8,12.7 38.1,12.7 | 21.08,8.89 JP5.2 21.08,11.68 | WI-FI.GND2 26.69,12.46 26.67,12.45 26.67,11.68 | v41.66,13.97 41.66,12.7 | 41.66,12.7 42.67,11.68 44.45,11.68 45.21,11.68 47.75,11.68 v50.04,11.68 | 41.66,12.7 38.1,12.7 | 38.1,12.7 38.15,12.75 WI-FI.GND1 | 21.08,11.68 21.59,11.68 24.38,11.68 26.67,11.68 | 26.67,11.68 30.73,11.68 | 50.29,11.68 v50.04,11.68 | v50.04,11.68 52.58,11.68 | 21.08,11.68 19.81,11.68 | 19.81,11.68 v19.81,15.49 | v82.8,20.32 82.8,18.8 82.8,15.24
  other vias: 72.9,16.26 74.42,16.26 22.86,42.04 24.64,42.04 25.53,42.04 26.42,42.04 23.75,39.24 24.64,39.24 25.53,39.24 26.42,39.24 23.75,42.04 26.42,42.93 25.53,42.93 24.64,42.93 23.75,42.93 22.86,38.35 23.75,38.35 24.64,38.35 25.53,38.35 26.42,38.35 26.42,40.13 26.42,41.15 22.86,40.13 22.86,41.15
  pour Bottom (isolate 0.254, no thermals): 74.17,45.72 74.17,41.91 74.42,41.66 76.71,41.66 76.96,41.91 76.96,45.72 76.71,45.97 74.42,45.97
  pour Bottom (isolate 0.305): 68.83,16.26 68.83,12.19 69.09,11.94 86.36,11.94 86.61,12.19 86.61,17.78 69.09,17.78
  pour Bottom: 66.29,48.26 66.29,42.16 73.66,42.16 73.66,48.26
  pour Top (isolate 0.254): 71.88,29.97 71.88,14.99 75.95,14.99 75.95,18.03 76.96,19.05 88.14,19.05 91.69,15.49 91.69,15.49 91.69,16 91.95,18.03 91.95,29.72 91.69,29.97 82.8,29.97 82.8,21.84 82.3,21.84 82.3,29.97 80.01,29.97 80.01,22.1 79.5,22.1 79.5,29.97
  pour Top (isolate 0.305): 68.07,39.62 68.07,34.04 79.25,34.04 80.52,35.31 80.52,42.16 69.85,42.16 69.6,41.91 69.6,40.39 68.83,39.62
  pour Bottom (isolate 0.254, no thermals): 22.61,38.1 26.67,38.1 26.67,43.18 22.61,43.18
  pour Bottom (isolate 0.254, no thermals): 27.43,50.8 27.43,47.75 28.45,46.74 31.5,46.99 31.75,46.23 31.24,28.7 7.11,28.7 7.11,43.18 10.16,46.23 12.45,46.23 14.99,48.77 14.73,50.55
GPIO_TB_9
  Top 0.406: R22.2 49.02,12.19 JP5.13 46.99,7.11 44.92,7.11 X6.3
GPIO_TB_10
  Top 0.406: JP5.14 48.51,6.1 47.4,6.1 X6.2
GPIO_TB_11
  Top 0.406: JP5.15 54.1,8.38 51.82,6.1 51.56,6.1 50.9,6.1 X6.1
I2C_SCL  (via drill 0.3)
  Top 0.254: U$4.3 33.78,49.53 35.56,47.75 38.1,47.75 39.12,46.74 49.02,46.74 v50.8,44.96
  Bottom 0.254: v50.8,44.96 51.05,44.7 63.75,44.7 64.26,44.2 64.26,42.16 UEXT.5
I2C_SDA  (via drill 0.3)
  Top 0.254: U$4.4 37.85,48.26 39.12,48.26 40.13,47.24 49.78,47.24 52.83,44.2 55.12,44.2 56.13,43.18 v55.88,43.18
  Bottom 0.254: v55.88,43.18 56.9,42.16 61.72,42.16 UEXT.6
IRQ  (via drill 0.3)
  Top 0.254: UART.IRQ 47.46,43.47 48.01,42.93 v48.01,40.89 | U2.8 88.04,37.74 88.9,38.61 89.92,38.61 90.42,38.1 90.42,33.53 93.98,29.97 v94.49,29.97 | v91.19,27.69 91.19,28.19 89.15,30.23 71.63,30.23 70.36,31.5 65.53,31.5 65.02,32 62.99,32 v62.74,32.26 | v44.96,30.48 44.96,28.96 | 44.96,28.96 44.96,27.43 v44.45,26.92 | v45.72,28.96 44.96,28.96
  Bottom 0.254: JP5.16 56.64,8.38 57.66,7.37 62.48,7.37 62.99,7.87 62.99,10.41 63.75,11.18 63.75,15.24 61.21,17.78 46.74,17.78 44.2,20.32 44.2,26.67 v44.45,26.92 | v44.96,30.48 44.96,39.12 45.47,39.62 45.97,39.62 47.24,40.89 v48.01,40.89 50.29,40.89 R1.1 | v94.49,29.97 92.2,27.69 v91.19,27.69 | v62.74,32.26 61.72,31.24 61.72,28.19 62.74,27.18 62.74,22.61 62.23,22.1 57.66,22.1 53.09,26.67 53.09,28.45 52.58,28.96 v45.72,28.96
MISO  (via drill 0.3)
  Top 0.254: NFC.29 79.83,45.4 80.52,44.7 80.52,43.94 81.53,42.93 81.53,41.4 82.3,40.64 83.31,40.64 84.07,39.88 v84.07,39.37 84.07,36.58 85.34,35.31 87.12,35.31 97.28,25.15 97.28,24.13 96.77,23.62 96.27,23.62 95.5,22.86 95.5,21.08 96.52,20.07 96.77,19.81 UEXT1.7 | U$4.5 40.89,47.75 50.55,47.75 v52.58,45.72 53.59,44.7 58.42,44.7 59.18,43.94 59.18,42.16 UEXT.7 60.45,40.39 61.21,39.62 61.21,35.81 62.48,34.54 65.02,34.54 66.55,33.02 79.25,33.02 81.53,35.31 81.53,38.1 v81.79,38.35 | UART.SO 51.56,42.17 49.53,44.2 v49.53,44.96 | U2.3 85.19,41 v85.09,40.89
  Bottom 0.254: v81.79,38.35 83.06,38.35 v84.07,39.37 85.09,40.39 v85.09,40.89 | v49.53,44.96 49.53,45.21 50.04,45.72 v52.58,45.72
MOSI  (via drill 0.3)
  Top 0.254: NFC.28 79.56,44.9 80.01,44.45 80.01,43.69 81.03,42.67 81.03,40.39 | 81.03,40.39 81.03,35.56 78.99,33.53 66.8,33.53 65.28,35.05 62.74,35.05 61.72,36.07 61.72,42.16 UEXT.8 58.67,45.21 54.36,45.21 51.31,48.26 42.93,48.26 U$4.6 | 81.03,40.39 v81.28,40.39 81.53,40.13 83.06,40.13 83.31,39.88 83.31,38.86 83.57,38.61 83.57,36.32 85.09,34.8 86.87,34.8 96.52,25.15 v96.52,24.64 | 52.45,41.53 UART.SI 51.45,41.52 48.01,44.96 v45.97,44.96 | U2.2 83.31,41.66 v82.8,42.16
  Bottom 0.254: v45.97,44.96 45.97,45.47 41.66,49.78 U$4.6 | v96.52,24.64 97.03,24.64 98.04,23.62 98.04,21.08 99.31,19.81 UEXT1.8 | v82.8,42.16 81.28,40.64 v81.28,40.39
MUX_A
  Top 0.254: MUX.11 28.5,22.81 29.72,21.59 29.72,20.07 32,17.78 33.27,17.78 33.78,17.27 JP5.7
MUX_B
  Top 0.254: JP5.8 36.07,9.4 36.07,15.75 33.53,18.29 32.26,18.29 30.23,20.32 30.23,21.84 28.6,23.47 MUX.10
MUX_C  (via drill 0.3)
  Top 0.254: MUX.9 28.7,24.13 30.73,22.1 30.73,20.57 32.51,18.8 33.78,18.8 36.58,16 36.58,11.43 v36.83,11.18
  Bottom 0.254: v36.83,11.18 JP5.9
N$1
  Top 0.254: NFC.4 71.94,44.4 71.63,44.96 70.87,46.23 70.87,47.24 70.36,47.75 66.29,47.75 65.53,48.51 65.02,48.51 L3.2
N$2
  Top 0.254: NFC.6 71.34,43.4 71.16,43.4 71.12,43.43 | 71.12,43.43 | 71.12,43.43 70.61,43.43 70.1,43.94 70.1,45.72 L4.2
N$3
  Top 0.254: C11.2 L3.1 C36.1
N$4
  Bottom 0.254: GSM1.16 41.08,32.84 40.64,33.27 40.64,33.53 39.62,34.54 39.62,37.59 39.37,37.85 38.61,37.85 38.86,38.1 Q5.3
N$5  (via drill 0.3)
  Top 0.254: v86.36,32 86.36,32.77 83.06,36.07 83.06,38.35 82.8,38.61 82.8,39.12 v82.55,39.37
  Bottom 0.254: v86.36,32 86.36,31.5 85.6,30.73 85.6,29.46 85.34,29.21 | 85.32,29.21 T1.1 | v82.55,39.37 82.55,40.64 83.82,41.91 JP13.1
  Bottom 0.406: 85.32,29.21 85.32,28.73 85.12,28.73 85.09,28.7 85.09,28.19 83.82,26.92 R48.2 | 85.34,29.21 85.34,29.19 T1.1
N$6
  Bottom 0.254: GSM1.9 40.97,25.84 40.13,26.67 40.13,29.97 39.62,30.48 R19.1 39.12,30.73 37.08,30.73 36.83,30.99 R17.2
N$7
  Top 0.254: NFC.14 74.89,40.09 73.66,38.86 73.66,36.58 | Y1.1 | Y1.1 74.93,36.58 73.91,36.58 73.66,36.58 | C17.1 72.39,36.58 73.66,36.58
N$8
  Top 0.254: 77.22,38.1 77.21,38.1 Y1.2 | NFC.15 75.39,39.92 76.2,39.12 76.71,39.12 76.96,38.86 76.96,38.35 Y1.2 | C20.1 77.39,38.35 Y1.2
N$9
  Bottom 0.406: R35.1 C35.1 71.88,37.4
N$10  (via drill 0.3)
  Top 0.254: NFC.9 71.61,41.9 v71.37,41.66
  Bottom 0.254: 75.06,37.34 75.06,40.26 74.93,40.39 73.41,40.39 72.9,40.89 71.88,40.89 71.37,41.4 v71.37,41.66 | C4.1 75.06,37.34 | R5.2 75.06,37.34
N$11  (via drill 0.3)
  Top 0.254: v70.87,40.64 71.63,40.64 72.26,41.27 72.39,41.4 72.52,41.4 72.51,41.4 NFC.10
  Bottom 0.254: C35.2 71.88,40.13 71.63,40.39 71.12,40.39 v70.87,40.64
  Bottom 0.406: C35.2 R5.1
N$12  (via drill 0.3)
  Top 0.254: v70.1,41.66 69.6,42.16 69.6,44.45 68.83,45.21 67.56,45.21 67.31,45.47 L4.1 67.31,46.74 66.29,46.74 65.28,47.75 61.47,47.75 60.71,48.51 60.71,50.55 59.94,51.31 57.91,51.31 C30.1 C32.2
  Bottom 0.254: v70.1,41.66 70.1,39.62 R35.2
N$13  (via drill 0.3)
  Top 0.254: R10.1 62.48,29.21 v62.74,28.96 | v62.74,30.99 63.25,31.5 64.77,31.5 65.28,30.99 70.1,30.99 71.37,29.72 88.9,29.72 89.66,28.96 89.66,28.12 89.66,27.43 89.53,27.3 SIM_HOLDER.6
  Bottom 0.254: v62.74,30.99 v62.74,28.96
N$14  (via drill 0.3)
  Top 0.254: v57.4,25.15 R14.2
  Bottom 0.254: GSM1.33 60.92,36.54 60.71,36.32 60.71,28.45 v57.4,25.15
N$16
  Top 0.254: R13.1 60.71,26.92 62.48,26.92 62.48,27.18 62.61,27.3 SIM_HOLDER.3
N$17
  Bottom 0.813: WI-FI.ANT 23.52,15.19 X2.1
N$18
  Top 0.254: R14.1 60.71,24.89 62.74,24.89 63.5,24.89 63.63,24.76 SIM_HOLDER.2
N$19  (via drill 0.3)
  Top 0.254: JP12.1 87.38,44.2 88.39,43.18 88.39,41.15 v88.65,40.89
  Bottom 0.254: R21.1 87.73,33.88 87.63,33.78 87.12,33.78 | T1.3 80.75,28.98 80.77,28.96 80.52,28.7 80.52,24.89 R8.2 | v88.65,40.89 89.15,40.89 89.66,41.4
  Bottom 0.61: C26.+ 91.83,41.54 91.69,41.4
  Bottom 0.813: 87.63,36.32 87.63,39.37 89.66,41.4 91.69,41.4
  Bottom 1.016: 87.12,33.78 86.36,33.78 83.82,31.24 81.28,31.24 80.75,30.71 T1.3 | R21.1 R15.2 87.63,36.32
N$20  (via drill 0.3)
  Top 0.254: v57.4,29.21 R10.2
  Bottom 0.254: GSM1.31 58.92,36.58 59.69,35.81 59.69,31.24 57.66,29.21 v57.4,29.21
N$21
  Bottom 0.254: GSM1.1 41.35,17.84 40.64,18.54 40.64,24.89 39.62,25.91 39.62,28.7 38.86,29.46 35.81,29.46 Q7.3
N$22  (via drill 0.3)